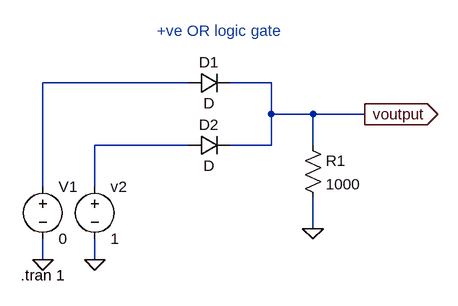
[diagram p0: schematic 1a.asc]
1a.asc, the LTspice schematic file:
Version 4
SHEET 1 880 680
WIRE 448 -64 224 -64
WIRE 576 -64 512 -64
WIRE 576 -16 576 -64
WIRE 640 -16 576 -16
WIRE 720 -16 640 -16
WIRE 448 32 304 32
WIRE 576 32 576 -16
WIRE 576 32 512 32
WIRE 640 32 640 -16
WIRE 224 96 224 -64
WIRE 304 96 304 32
WIRE 640 160 640 112
WIRE 224 208 224 176
WIRE 304 208 304 176
FLAG 224 208 0
FLAG 304 208 0
FLAG 640 160 0
FLAG 720 -16 voutput
IOPIN 720 -16 Out
SYMBOL voltage 304 80 R0
WINDOW 123 0 0 Left 0
WINDOW 39 0 0 Left 0
SYMATTR InstName v2
SYMATTR Value 1
SYMBOL diode 448 -48 R270
WINDOW 0 32 32 VTop 2
WINDOW 3 0 32 VBottom 2
SYMATTR InstName D1
SYMBOL diode 448 48 R270
WINDOW 0 32 32 VTop 2
WINDOW 3 0 32 VBottom 2
SYMATTR InstName D2
SYMBOL res 624 16 R0
SYMATTR InstName R1
SYMATTR Value 1000
SYMBOL voltage 224 80 R0
WINDOW 123 0 0 Left 0
WINDOW 39 0 0 Left 0
SYMATTR InstName V1
SYMATTR Value 0
TEXT 400 -144 Left 2 ;+ve OR logic gate
TEXT 190 232 Left 2 !.tran 1

The netlist it stands for:
* 1a.asc
v2 N002 0 1
D1 N001 voutput D
D2 N002 voutput D
R1 voutput 0 1000
V1 N001 0 0
.model D D
.lib standard.dio
* +ve OR logic gate
.tran 1
.backanno
.end